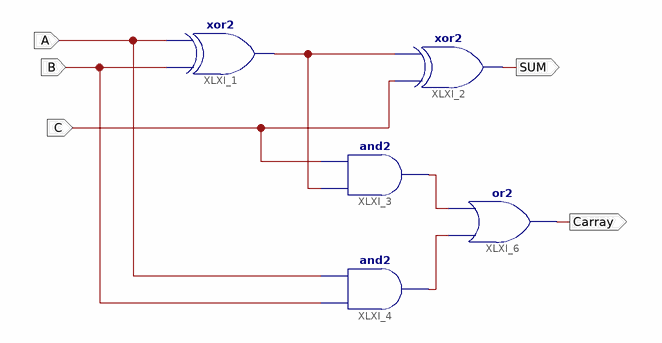
[diagram p0: schematic sheet 1]
// Xilinx ISE schematic fullAdder.sch (spartan6) as structural Verilog: 5 symbols, 5 ports
module fullAdder (
  input  A,
  input  B,
  input  C,
  output SUM,
  output Carray
);

  wire XLXN_6, XLXN_7, XLXN_8;

  xor XLXI_1 (XLXN_6, B, A);
  xor XLXI_2 (SUM, C, XLXN_6);
  and XLXI_3 (XLXN_7, XLXN_6, C);
  and XLXI_4 (XLXN_8, B, A);
  or XLXI_6 (Carray, XLXN_8, XLXN_7);
endmodule
